# Altium schematic sheet M2.SchDoc
size A; SheetNumber: 1; SheetTotal: 1
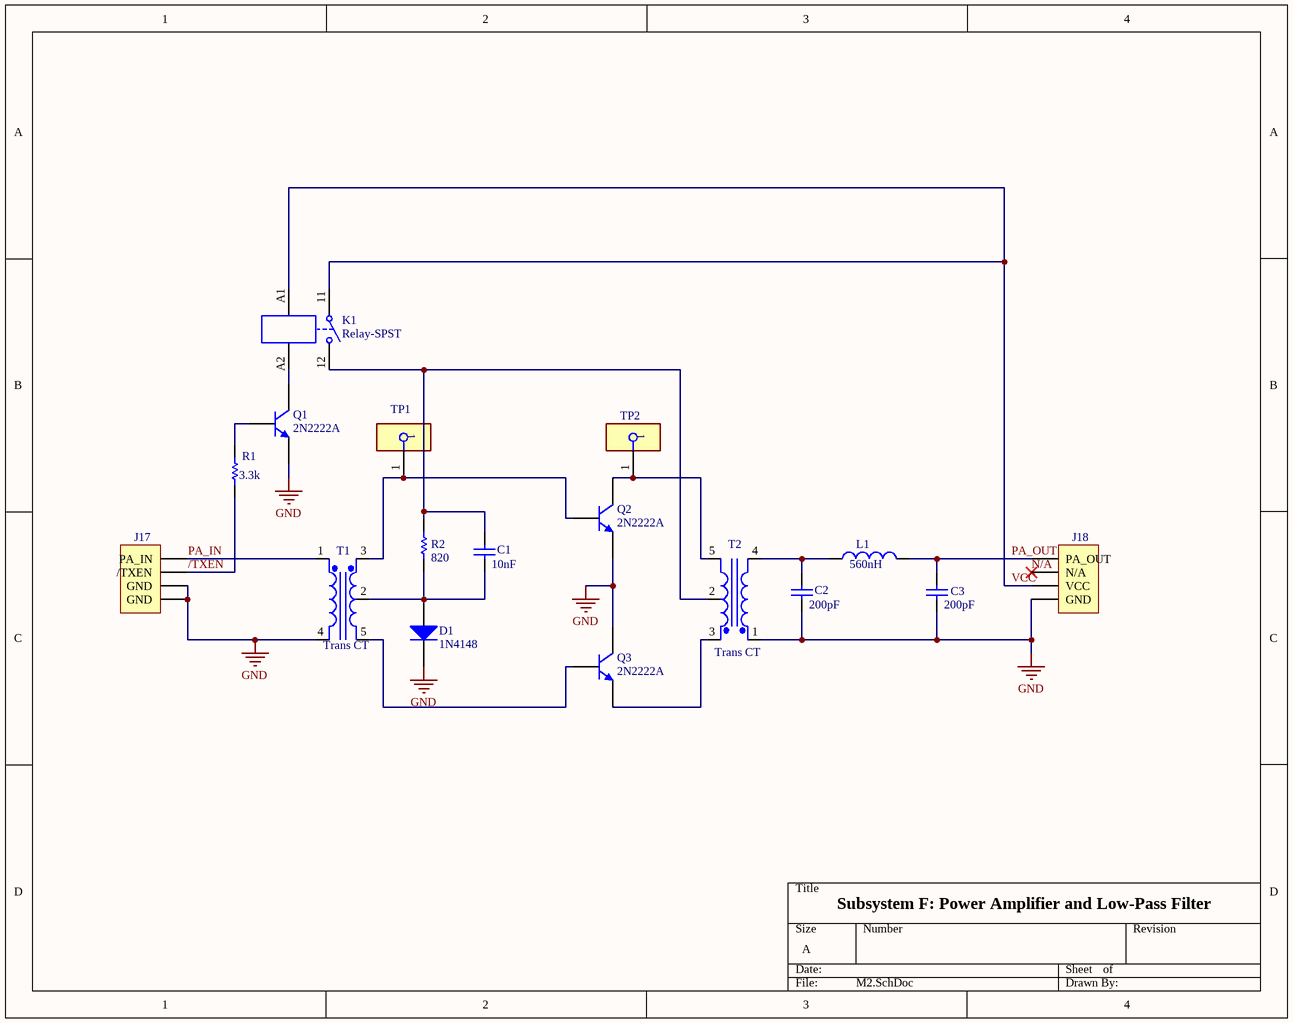
[diagram p0: M2.SchDoc]

## Parts
C1  value 10nF  [RADIAL-0.1]  (hidden comment: Cap)
C2  value 200pF  [RADIAL-0.1]  (hidden comment: Cap)
C3  C3  value 200pF  [RADIAL-0.1]
D1  1N4148  [DO-35]
J17  Header 4  [HDR1X4]  (value not drawn)
J18  Header 4  [HDR1X4]  (value not drawn)
K1  Relay-SPST  [PCBComponent_1]
L1  value 560nH  [New Inductor]  (hidden comment: Inductor)
Q1  2N2222A  [TO127P584H533-3]
Q2  2N2222A  [TO127P584H533-3]
Q3  2N2222A  [TO127P584H533-3]
R1  value 3.3k  [AXIAL-0.1-RES]  (hidden comment: Res1)
R2  R2  value 820  [AXIAL-0.1-RES]
T1  Trans CT  [BIFILAR-2402]
T2  Trans CT  [BIFILAR-2402]
TP1  5006  [FP-5006-MFG]  (value not drawn)
TP2  5006  [FP-5006-MFG]  (value not drawn)

## Nets
GND: C2.1 C3.1 D1.2(K) J17.3(GND) J17.4(GND) J18.4(GND) Q1.3(E) Q2.3(E) Q3.2(C) T1.4(Pri-) T2.1(Pri+)
/TXEN: J17.2(/TXEN) R1.2
N/A: J18.2(N/A)
PA_IN: J17.1(PA_IN) T1.1(Pri+)
PA_OUT: C3.2 J18.1(PA_OUT) L1.2
VCC: J18.3(VCC) K1.11 K1.A1
NetC1_1: C1.1 D1.1(A) R2.1 T1.2(SecCT)
NetC1_2: C1.2 K1.12 R2.2 T2.2(SecCT)
NetC2_2: C2.2 L1.1 T2.4(Pri-)
NetK1_A2: K1.A2 Q1.2(C)
NetQ1_1: Q1.1(B) R1.1
NetQ2_1: Q2.1(B) T1.3(Sec+) TP1.1
NetQ2_2: Q2.2(C) T2.5(Sec-) TP2.1
NetQ3_1: Q3.1(B) T1.5(Sec-)
NetQ3_3: Q3.3(E) T2.3(Sec+)

## Notes on the sheet
- Subsystem F: Power Amplifier and Low-Pass Filter

## Library data of the parts
C1 = CAP CER 10000PF 50V Z5U RADIAL: Capacitor; Manufacturer Part Number: C317C103M5U5TA; Designator: C?; Voltage Rating: 50V; Published: 8-Jun-2000; LatestRevisionDate: 17-Jul-2002; LatestRevisionNote: Re-released for DXP Platform.; Publisher: Altium Limited
C2 C3 = CAP CER 100PF 50V C0G/NP0 RADIAL: Capacitor; Manufacturer Part Number: K101K15C0GF53L2; Designator: C?; Voltage Rating: 50V; Published: 8-Jun-2000; LatestRevisionDate: 17-Jul-2002; LatestRevisionNote: Re-released for DXP Platform.; Publisher: Altium Limited
D1 = Diode 1N4148: High Conductance Fast Diode; Published: 8-Jun-2000; LatestRevisionDate: 17-Jul-2002; LatestRevisionNote: Re-released for DXP Platform.; DatasheetVersion: 1997; PackageReference: DO-35; Publisher: Altium Limited; PackageDescription: Diode, Axial; Body 3.8 x 1.9 mm (LxDia. max), Lead Dia. 0.53 mm (max); Code_JEDEC: DO-204-AH; ComponentLink1Description: Manufacturer Link; ComponentLink1URL: http://www.fairchildsemi.com/; ComponentLink2Description: Datasheet; ComponentLink2URL: http://www.fairchildsemi.com/ds/1N%2F1N4148.pdf
J17 J18 = Header 4: Header, 4-Pin; LatestRevisionDate: 17-Jul-2002; LatestRevisionNote: Re-released for DXP Platform.; Publisher: Altium Limited
K1 = Relay-SPST: Single-Pole Single-Throw Relay; Published: 24-Mar-1999; LatestRevisionDate: 17-Jul-2002; LatestRevisionNote: Re-released for DXP Platform.; PackageReference: MODULE4; Publisher: Altium Limited
L1 = Inductor: Ind RF Choke Bobbin Core 560nH 10% 25MHz 40Q-Factor Ferrite 950mA AXL Bag; Manufacturer: TDK; Manufacturer Part Number: MLF1608DR56K; Code_IEC: 1005; Self Resonant Frequency: 230MHz; Current Rating: 100mA; Shielding: Shielded; DC Resistance (DCR): 1.05R; Q Factor: 15; Inductor Type: Multilayer; Lead/Base Style: Axial; Lead Diameter: 0.51mm; Published: 8-Jun-2000; LatestRevisionDate: 29-May-2009; LatestRevisionNote: IPC-7351 Footprint Added.; PackageReference: 0402-A; Publisher: Altium Limited; PackageDescription: Chip Inductor; Code_JEITA: 0402; Supplier 1: Newark; RoHS: Yes; Category: Fixed Inductors; Stock 1: 4000; Pricing 1: 1=0.34500, 10=0.20100, 25=0.16900, 50=0.13700, 100=0.11000, 500=0.09300 (USD); Mount: Surface Mount; Case/Package: 0603; Number of Pins: 2; Case Code (Metric): 1608; Case Code (Imperial): 0603; Core Material: Ferrite; Weight: 0.000141oz; Min Operating Temperature: -55°C; Max Operating Temperature: 85°C; Package Quantity: 4000; Series: MLF; Tolerance: 10%; Packaging: Tape and Reel; Inductance: 560nH; Test Frequency: 25MHz; Max DC Current: 100mA; Termination: SMD/SMT; Inductance Tolerance: 10%; DC Current: 100mA; Length: 0.063inch; Width: 0.031inch; Height: 0.031inch; Depth: 0.95mm; RoHS Compliant: Yes; REACH SVHC: No SVHC; Military Standard: Not; Lead Free: Lead Free; ComponentLink1URL: https://datasheet.ciiva.com/15986/tdk5158-15986859.pdf?src-supplier=Onlinecomponents.com; ComponentLink1Description: https://datasheet.ciiva.com/15986/tdk5158-15986859.pdf?src-supplier=Onlinecomponents.com; ComponentLink2URL: https://datasheet.ciiva.com/8045/321058-8045404.pdf?src-supplier=Element14; ComponentLink2Description: https://datasheet.ciiva.com/8045/321058-8045404.pdf?src-supplier=Element14; Supplier 2: Newark; Stock 2: 2083; Pricing 2: 1=0.33000, 10=0.24000, 25=0.22500, 50=0.21100, 100=0.19600, 500=0.16300 (USD); Contact Plating: Tin; Diameter: 2.79mm; ComponentLink3URL: https://datasheet.ciiva.com/6711/78f-series-6711829.pdf?src-supplier=Digi-Key; ComponentLink3Description: https://datasheet.ciiva.com/6711/78f-series-6711829.pdf?src-supplier=Digi-Key; ComponentLink4URL: https://datasheet.ciiva.com/1474/78f-series-1474743.pdf?src-supplier=Element14; ComponentLink4Description: https://datasheet.ciiva.com/1474/78f-series-1474743.pdf?src-supplier=Element14; Supplier 3: Newark; Supplier Part Number 3: 63K2915; Stock 3: 2083; Pricing 3: 1=0.33000, 10=0.24000, 25=0.22500, 50=0.21100, 100=0.19600, 500=0.16300 (USD)
Q1-Q3 = CMP-2000-05381-1: High Speed Switch, 0.6 A IC, -65 to 175 degC, 3-Pin TO-18, RoHS, Bulk; Manufacturer: STMicroelectronics; Power Dissipation Pd: 500mW; DC Current Gain hFE: 300hFE; Transistor Polarity: NPN; DC Collector Current: 600mA; No. of Pins: 3Pins; Transition Frequency ft: 300MHz; Collector Emitter Voltage V(br)ceo: 40V; Product Range: -; Package Reference: TO-18-3; Datasheet URL: https://datasheet.ciiva.com/25917/cd00003223-25917094.pdf; Automotive Qualification Standard: -; Transistor Case Style: TO-18; Operating Temperature Max: 175degC; Datasheet Version: Feb-03; Package Description: 3-Pin Through Hole Device, Dia 5.8 mm, Pitch 1.27 mm; Manufacturer URL: http://www.st.com/
R1 = RES 1K OHM 5% 1/4W AXIAL: Resistor; Manufacturer Part Number: CFR-25JB-52-1K; Designator: R?; Power Rating: 1/4W; Tolerance: 0.05; Published: 8-Jun-2000; LatestRevisionDate: 17-Jul-2002; LatestRevisionNote: Re-released for DXP Platform.; Publisher: Altium Limited
R2 = RES 820 OHM 5% 1/4W AXIAL: Resistor; Manufacturer Part Number: CFR-25JB-52-820R; Designator: R?; Power Rating: 1/4W; Tolerance: 0.05; Published: 8-Jun-2000; LatestRevisionDate: 17-Jul-2002; LatestRevisionNote: Re-released for DXP Platform.; Publisher: Altium Limited
T1 T2 = Trans CT: Common Mode Chokes / Filters WE-SL 100uH 700mA DCR=100mOhms; Manufacturer: Wurth Electronics; Manufacturer Part Number: 744205; Core Material: Ferrite; Tolerance: 35%; DC Resistance (DCR): 100mR; Impedance: 900R; Published: 8-Jun-2000; LatestRevisionDate: 17-Jul-2002; LatestRevisionNote: Re-released for DXP Platform.; PackageReference: TRF_5; Publisher: Altium Limited; PackageDescription: Transformer; 5 Leads; Supplier 1: Newark; Supplier Part Number 1: 82Y7768; RoHS: Yes; Category: Common Mode Chokes; Stock 1: 541; Pricing 1: 1=3.56000, 10=3.52000, 25=3.48000, 50=3.44000, 100=3.16000, 500=2.90000 (USD); Case/Package: SMD/SMT; Min Operating Temperature: -40°C; Max Operating Temperature: 125°C; Inductance: 100uH; Max DC Current: 700mA; Current Rating: 700mA; Length: 12.7mm; Depth: 10.5mm; REACH SVHC: Unknown; RoHS Compliant: Yes; ComponentLink1URL: https://datasheet.ciiva.com/11803/0900766b800335d0-11803154.pdf?src-supplier=RSComponents; ComponentLink1Description: https://datasheet.ciiva.com/11803/0900766b800335d0-11803154.pdf?src-supplier=RSComponents
TP1 TP2 = CMP-19636-000022-1: PC TEST POINT COMPACT BLACK; Body Material: Bronze; Inside Diameter: 1.78mm; Number of Ports: 1; Hole Diameter: 1.6mm; Outside Diameter: 3.18mm; Plating: Silver; Contact Plating: Tin; Color: Black; RoHS Compliant: Yes; Flammability Rating: UL94 V-0; Contact Material: Bronze; Material: Nylon; Orientation: Straight; Package Quantity: 100; Housing Color: Black; Length: 8.89mm; Series: THM; Mount: PCB; Height: 0.35inch; Packaging: Bulk; REACH SVHC: No SVHC; Insulation Material: Nylon; Lead Free: Lead Free